# EAGLE design sapflux_base_v2.1 (EAGLE 8.5.2)
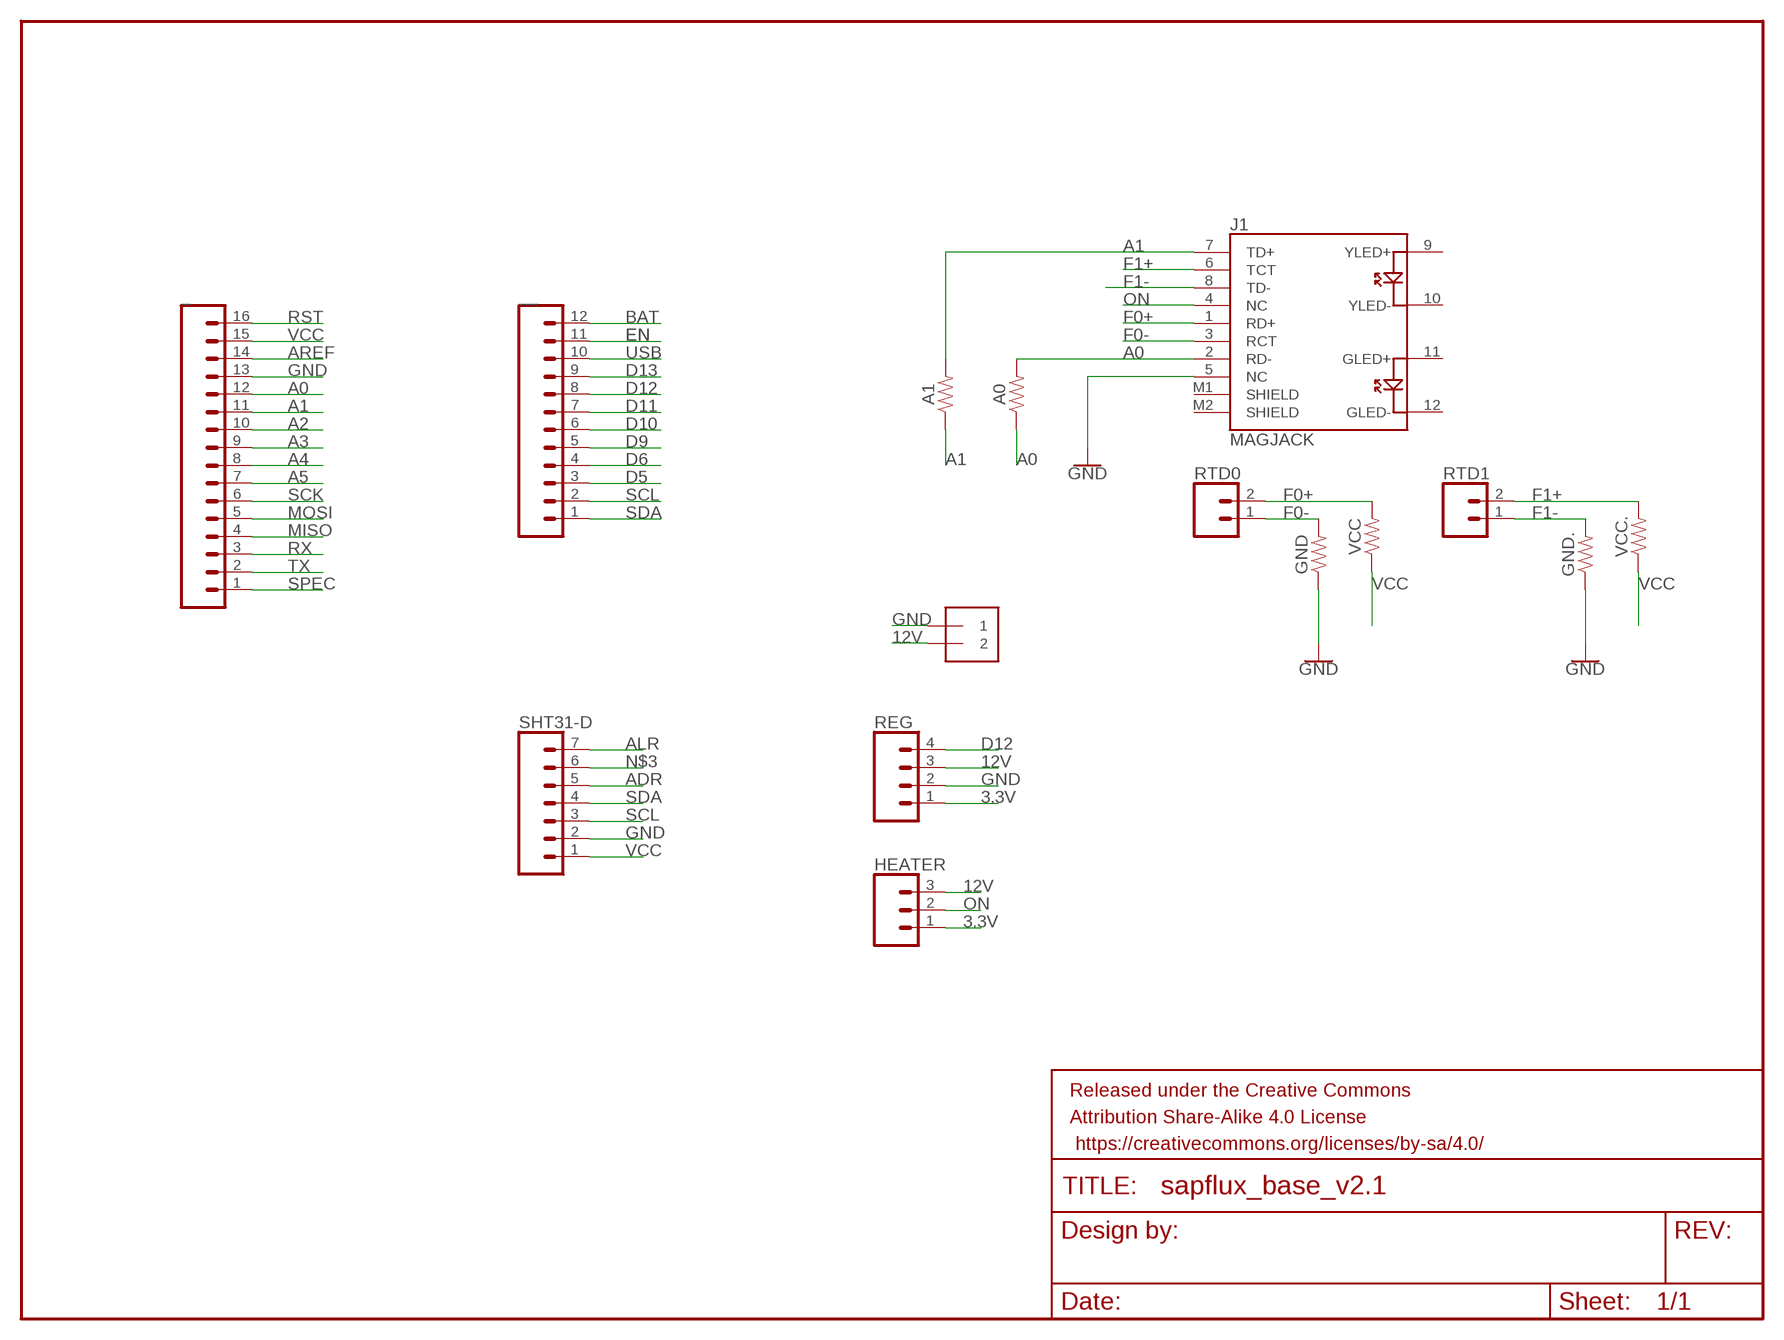
[diagram p0: schematic, sheet 1]

## Parts
.  1X2-3.5MM  [1X2-3.5MM]
_  CONN_16  [1X16]
__  CONN_12  [1X12]
A0  1.8MOHM  [0603]
A1  1.8MOHM  [0603]
FRAME1  FRAME-LETTER  [CREATIVE_COMMONS]
GND  1.8MOHM  [0603]
GND.  1.8MOHM  [0603]
HEATER  CONN_03  [1X03]
J1  MAGJACK  [MAGJACK]
REG  CONN_04  [1X04]
RTD0  CONN_02  [1X02]
RTD1  CONN_02  [1X02]
SHT31-D  CONN_07  [1X07]
VCC  1.8MOHM  [0603]
VCC.  1.8MOHM  [0603]

## Nets
3.3V: HEATER.1 REG.1
12V: ..2 HEATER.3 REG.3
A0: _.12 A0.1 A0.2 J1.2(RD-)
A1: _.11 A1.1 A1.2 J1.7(TD+)
A2: _.10
A3: _.9
A4: _.8
A5: _.7
ADR: SHT31-D.5
ALR: SHT31-D.7
AREF: _.14
BAT: __.12
D5: __.3
D6: __.4
D9: __.5
D10: __.6
D11: __.7
D12: __.8 REG.4
D13: __.9
EN: __.11
F0+: J1.1(RD+) RTD0.2 VCC.2
F0-: GND.2 J1.3(RCT) RTD0.1
F1+: J1.6(TCT) RTD1.2 VCC..2
F1-: GND..2 J1.8(TD-) RTD1.1
GND: ..1 _.13 GND.1 GND..1 J1.5(NC) REG.2 SHT31-D.2
MISO: _.4
MOSI: _.5
N$3: SHT31-D.6
ON: HEATER.2 J1.4(NC)
RST: _.16
RX: _.3
SCK: _.6
SCL: __.2 SHT31-D.3
SDA: __.1 SHT31-D.4
SPEC: _.1
TX: _.2
USB: __.10
VCC: _.15 SHT31-D.1 VCC.1 VCC..1
Unconnected: J1.9(YLED+) J1.10(YLED-) J1.11(GLED+) J1.12(GLED-) J1.M1(SHIELD) J1.M2(SHIELD)

## Library data of the parts
. = adafruit:1X2: 3.5mm Terminal block http://www.ladyada.net/library/pcb/eaglelibrary.html
_ = SparkFun-Connectors:CONN_16: Multi connection point. Often used as Generic Header-pin footprint for 0.1 inch spaced/style header connections On any of the 0.1 inch spaced packages, you can populate with these: Break Away Headers - Straight <https://www.sparkfun.com/products/116> (PRT-00116) Break Away Male Headers - Right Angle <https://www.sparkfun.com/products/553> (PRT-00553) Female Headers <https://www.sparkfun.com/products/115> (PRT-00115) Break Away Headers - Machine Pin <https://www.sparkfun.com/products/117> (PRT-00117) Break Away Female Headers - Swiss Machine Pin <https://www.sparkfun.com/products/743> (PRT-00743) For SCREWTERMINALS and SPRING TERMINALS visit here: Screw Terimnals on SparkFun.com <https://www.sparkfun.com/search/results?term=Screw+Terminals> (5mm/3.5mm/2.54mm spacing) This device is also useful as a general connection point to wire up your design to another part of your project. Our various solder wires solder well into these plated through hole pads. Hook-Up Wire - Assortment (Stranded, 22 AWG) <https://www.sparkfun.com/products/11375> (PRT-11375) Hook-Up Wire - Assortment (Solid Core, 22 AWG) <https://www.sparkfun.com/products/11367> (PRT-11367) View the entire wire category on our website here <https://www.sparkfun.com/categories/141> Special notes: Molex polarized connector foot print use with SKU : PRT-08231 with associated crimp pins and housings. 1MM SMD Version SKU: PRT-10208 NOTES ON THE VARIANTS LOCK and LOCK_LONGPADS... This footprint was designed to help hold the alignment of a through-hole component (i.e. 6-pin header) while soldering it into place. You may notice that each hole has been shifted either up or down by 0.005 of an inch from it's more standard position (which is a perfectly straight line). This slight alteration caused the pins (the squares in the middle) to touch the edges of the holes. Because they are alternating, it causes a "brace" to hold the component in place. 0.005 has proven to be the perfect amount of "off-center" position when using our standard breakaway headers. Although looks a little odd when you look at the bare footprint, once you have a header in there, the alteration is very hard to notice. Also,if you push a header all the way into place, it is covered up entirely on the bottom side.
__ = SparkFun-Connectors:CONN_12: Multi connection point. Often used as Generic Header-pin footprint for 0.1 inch spaced/style header connections On any of the 0.1 inch spaced packages, you can populate with these: Break Away Headers - Straight <https://www.sparkfun.com/products/116> (PRT-00116) Break Away Male Headers - Right Angle <https://www.sparkfun.com/products/553> (PRT-00553) Female Headers <https://www.sparkfun.com/products/115> (PRT-00115) Break Away Headers - Machine Pin <https://www.sparkfun.com/products/117> (PRT-00117) Break Away Female Headers - Swiss Machine Pin <https://www.sparkfun.com/products/743> (PRT-00743) For SCREWTERMINALS and SPRING TERMINALS visit here: Screw Terimnals on SparkFun.com <https://www.sparkfun.com/search/results?term=Screw+Terminals> (5mm/3.5mm/2.54mm spacing) This device is also useful as a general connection point to wire up your design to another part of your project. Our various solder wires solder well into these plated through hole pads. Hook-Up Wire - Assortment (Stranded, 22 AWG) <https://www.sparkfun.com/products/11375> (PRT-11375) Hook-Up Wire - Assortment (Solid Core, 22 AWG) <https://www.sparkfun.com/products/11367> (PRT-11367) View the entire wire category on our website here <https://www.sparkfun.com/categories/141> Special notes: Molex polarized connector foot print use with SKU : PRT-08231 with associated crimp pins and housings. 1MM SMD Version SKU: PRT-10208 NOTES ON THE VARIANTS LOCK and LOCK_LONGPADS... This footprint was designed to help hold the alignment of a through-hole component (i.e. 6-pin header) while soldering it into place. You may notice that each hole has been shifted either up or down by 0.005 of an inch from it's more standard position (which is a perfectly straight line). This slight alteration caused the pins (the squares in the middle) to touch the edges of the holes. Because they are alternating, it causes a "brace" to hold the component in place. 0.005 has proven to be the perfect amount of "off-center" position when using our standard breakaway headers. Although looks a little odd when you look at the bare footprint, once you have a header in there, the alteration is very hard to notice. Also,if you push a header all the way into place, it is covered up entirely on the bottom side.
A0 A1 GND GND. VCC VCC. = SparkFun-Resistors 2:1.8MOHM: 1.8 MOhms ±5% 0.1W, 1/10W Chip Resistor 0603; PROD_ID: RES-13994; VALUE: 1.8M
FRAME1 = SparkFun-Aesthetics:FRAME-LETTER: Schematic Frame - Letter Standard 8.5x11 US Letter frame
HEATER = SparkFun-Connectors:CONN_03: Multi connection point. Often used as Generic Header-pin footprint for 0.1 inch spaced/style header connections On any of the 0.1 inch spaced packages, you can populate with these: Break Away Headers - Straight <https://www.sparkfun.com/products/116> (PRT-00116) Break Away Male Headers - Right Angle <https://www.sparkfun.com/products/553> (PRT-00553) Female Headers <https://www.sparkfun.com/products/115> (PRT-00115) Break Away Headers - Machine Pin <https://www.sparkfun.com/products/117> (PRT-00117) Break Away Female Headers - Swiss Machine Pin <https://www.sparkfun.com/products/743> (PRT-00743) Stackable Header - 3 Pin (Female, 0.1") <https://www.sparkfun.com/products/13875> (PRT-13875) For SCREWTERMINALS and SPRING TERMINALS visit here: Screw Terimnals on SparkFun.com <https://www.sparkfun.com/search/results?term=Screw+Terminals> (5mm/3.5mm/2.54mm spacing) This device is also useful as a general connection point to wire up your design to another part of your project. Our various solder wires solder well into these plated through hole pads. Hook-Up Wire - Assortment (Stranded, 22 AWG) <https://www.sparkfun.com/products/11375> (PRT-11375) Hook-Up Wire - Assortment (Solid Core, 22 AWG) <https://www.sparkfun.com/products/11367> (PRT-11367) View the entire wire category on our website here <https://www.sparkfun.com/categories/141> Special notes: Molex polarized connector foot print use with SKU : PRT-08232 with associated crimp pins and housings.; PROD_ID: XXX-00000; VALUE: 455-1750-1-ND
J1 = SparkFun-Connectors:MAGJACK: MAGJACK: RJ-45 with LEDs This is a single port, RJ45 ethernet jacks with built in transformer (magnetics), status LEDs, and shielding. Here is the connector we sell at SparkFun: RJ45 Ethernet MagJack-Compatible <https://www.sparkfun.com/products/8534> (PRT-08534) Datasheet <http://www.sparkfun.com/datasheets/Prototyping/MagJack.pdf> It is used on this SparkFun product: SparkFun RJ45 MagJack Breakout <https://www.sparkfun.com/products/13021> (BOB-13021); PROD_ID: CONN-09556; SF_ID: PRT-08534
REG = SparkFun-Connectors:CONN_04: Multi connection point. Often used as Generic Header-pin footprint for 0.1 inch spaced/style header connections On any of the 0.1 inch spaced packages, you can populate with these: Break Away Headers - Straight <https://www.sparkfun.com/products/116> (PRT-00116) Break Away Male Headers - Right Angle <https://www.sparkfun.com/products/553> (PRT-00553) Female Headers <https://www.sparkfun.com/products/115> (PRT-00115) Break Away Headers - Machine Pin <https://www.sparkfun.com/products/117> (PRT-00117) Break Away Female Headers - Swiss Machine Pin <https://www.sparkfun.com/products/743> (PRT-00743) For SCREWTERMINALS and SPRING TERMINALS visit here: Screw Terimnals on SparkFun.com <https://www.sparkfun.com/search/results?term=Screw+Terminals> (5mm/3.5mm/2.54mm spacing) This device is also useful as a general connection point to wire up your design to another part of your project. Our various solder wires solder well into these plated through hole pads. Hook-Up Wire - Assortment (Stranded, 22 AWG) <https://www.sparkfun.com/products/11375> (PRT-11375) Hook-Up Wire - Assortment (Solid Core, 22 AWG) <https://www.sparkfun.com/products/11367> (PRT-11367) View the entire wire category on our website here <https://www.sparkfun.com/categories/141> Special notes: Molex polarized connector foot print use with SKU : PRT-08231 with associated crimp pins and housings. 1MM SMD Version SKU: PRT-10208; PROD_ID: CONN-09696
RTD0 RTD1 = SparkFun-Connectors:CONN_02: Multi connection point. Often used as Generic Header-pin footprint for 0.1 inch spaced/style header connections On any of the 0.1 inch spaced packages, you can populate with these: Break Away Headers - Straight <https://www.sparkfun.com/products/116> (PRT-00116) Break Away Male Headers - Right Angle <https://www.sparkfun.com/products/553> (PRT-00553) Female Headers <https://www.sparkfun.com/products/115> (PRT-00115) Break Away Headers - Machine Pin <https://www.sparkfun.com/products/117> (PRT-00117) Break Away Female Headers - Swiss Machine Pin <https://www.sparkfun.com/products/743> (PRT-00743) For SCREWTERMINALS and SPRING TERMINALS visit here: Screw Terimnals on SparkFun.com <https://www.sparkfun.com/search/results?term=Screw+Terminals> (5mm/3.5mm/2.54mm spacing) This device is also useful as a general connection point to wire up your design to another part of your project. Our various solder wires solder well into these plated through hole pads. Hook-Up Wire - Assortment (Stranded, 22 AWG) <https://www.sparkfun.com/products/11375> (PRT-11375) Hook-Up Wire - Assortment (Solid Core, 22 AWG) <https://www.sparkfun.com/products/11367> (PRT-11367) View the entire wire category on our website here <https://www.sparkfun.com/categories/141> Special notes: Molex polarized connector foot print use with: PRT-08233 with associated crimp pins and housings. 2.54_SCREWTERM for use with PRT-10571. 3.5mm Screw Terminal footprints for PRT-08084 5mm Screw Terminal footprints for use with PRT-08432
SHT31-D = SparkFun-Connectors:CONN_07: Multi connection point. Often used as Generic Header-pin footprint for 0.1 inch spaced/style header connections On any of the 0.1 inch spaced packages, you can populate with these: Break Away Headers - Straight <https://www.sparkfun.com/products/116> (PRT-00116) Break Away Male Headers - Right Angle <https://www.sparkfun.com/products/553> (PRT-00553) Female Headers <https://www.sparkfun.com/products/115> (PRT-00115) Break Away Headers - Machine Pin <https://www.sparkfun.com/products/117> (PRT-00117) Break Away Female Headers - Swiss Machine Pin <https://www.sparkfun.com/products/743> (PRT-00743) For SCREWTERMINALS and SPRING TERMINALS visit here: Screw Terimnals on SparkFun.com <https://www.sparkfun.com/search/results?term=Screw+Terminals> (5mm/3.5mm/2.54mm spacing) This device is also useful as a general connection point to wire up your design to another part of your project. Our various solder wires solder well into these plated through hole pads. Hook-Up Wire - Assortment (Stranded, 22 AWG) <https://www.sparkfun.com/products/11375> (PRT-11375) Hook-Up Wire - Assortment (Solid Core, 22 AWG) <https://www.sparkfun.com/products/11367> (PRT-11367) View the entire wire category on our website here <https://www.sparkfun.com/categories/141> Special notes: Molex polarized connector foot print use with SKU : PRT-08231 with associated crimp pins and housings. 1MM SMD Version SKU: PRT-10208 NOTES ON THE VARIANTS LOCK and LOCK_LONGPADS... This footprint was designed to help hold the alignment of a through-hole component (i.e. 6-pin header) while soldering it into place. You may notice that each hole has been shifted either up or down by 0.005 of an inch from it's more standard position (which is a perfectly straight line). This slight alteration caused the pins (the squares in the middle) to touch the edges of the holes. Because they are alternating, it causes a "brace" to hold the component in place. 0.005 has proven to be the perfect amount of "off-center" position when using our standard breakaway headers. Although looks a little odd when you look at the bare footprint, once you have a header in there, the alteration is very hard to notice. Also,if you push a header all the way into place, it is covered up entirely on the bottom side.

## Net classes
0 default: width 0.254 mm, clearance 0.205 mm
1 GND: width 0.61 mm

## Board
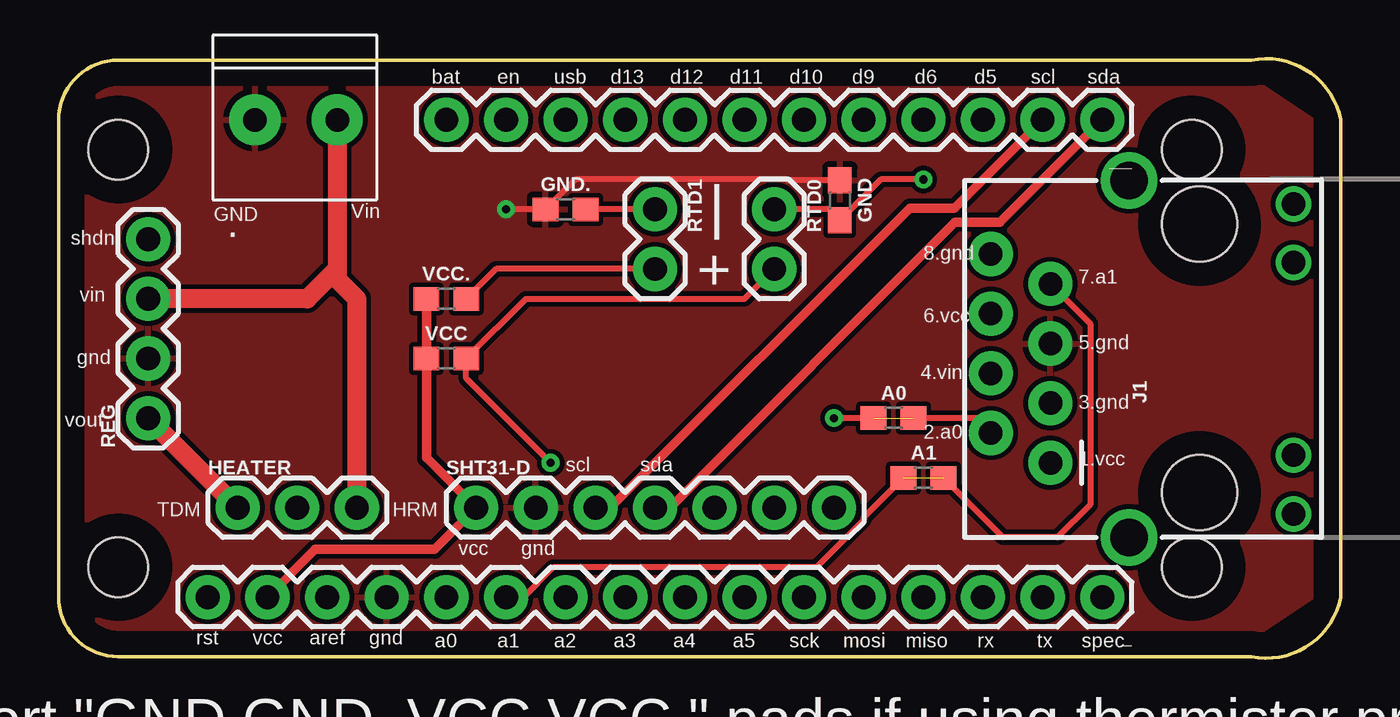
[diagram p1: board, top side]
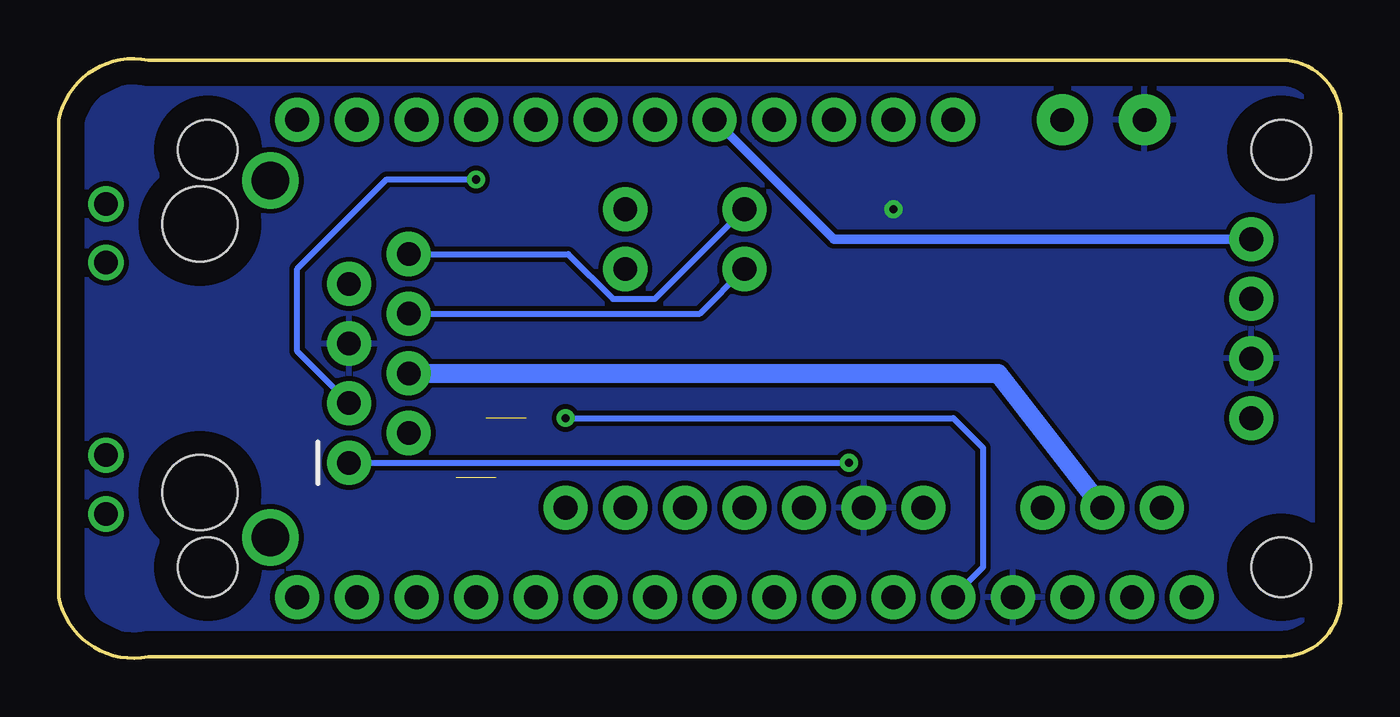
[diagram p2: board, bottom side, seen from below]

Size 54.61 x 25.53 mm. Coordinates in mm from the lower left corner, seen from the top.
Outline: 0,22.92 0,2.6 arc90 2.54,0.06 50.8,0.06 arc90 54.61,2.6 54.61,22.92 arc90 50.8,25.46 2.54,25.46 arc90 0,22.92
Copper layers (1*16): Top 0.035mm / dielectric 1.5mm / Bottom 0.035mm
Design rules "default": minimum track width 6mil, minimum drill 0.35mm, track to track 6mil, track to pad 6mil, pad to pad 6mil, via to via 6mil, smd to smd 6mil, copper to edge 40mil, drill to drill 6mil, minimum pad ring 10mil, minimum via ring 8mil, stop-mask expansion 4mil, vias tented up to drill 0mil, thermal gap 10mil
Holes 2.54 mm at 48.26,3.87 48.26,21.65 2.54,3.87 2.54,21.65

### Footprints (pad centres in the part's own frame; a part is rotated, then mirrored left to right if it is on the bottom)
1X2-3.5MM = drill 1 pad 2.184: 1 1.8,0; 2 -1.7,0
1X16 = drill 1.016 pad 1.88: 1 0,0; 2 2.54,0; 3 5.08,0; 4 7.62,0; 5 10.16,0; 6 12.7,0; 7 15.24,0; 8 17.78,0; 9 20.32,0; 10 22.86,0; 11 25.4,0; 12 27.94,0; 13 30.48,0; 14 33.02,0; 15 35.56,0; 16 38.1,0
1X12 = drill 1.016 pad 1.88: 1 0,0; 2 2.54,0; 3 5.08,0; 4 7.62,0; 5 10.16,0; 6 12.7,0; 7 15.24,0; 8 17.78,0; 9 20.32,0; 10 22.86,0; 11 25.4,0; 12 27.94,0
0603 = smd 1.1 x 1: 1 -0.85,0; 2 0.85,0
1X03 = drill 1.016 pad 1.88: 1 0,0; 2 2.54,0; 3 5.08,0
MAGJACK = drill 1 pad 1.88: 1 3.175,17.445; 2 4.445,19.985; 3 5.715,17.445; 4 6.985,19.985; 5 8.255,17.445; 6 9.525,19.985; 7 10.795,17.445; 8 12.065,19.985 | drill 1 pad 1.27: 9 1,7.1; 10 3.5,7.1; 11 11.7,7.1; 12 14.2,7.1 | drill 1.6 pad 2.184: M1 0,14.1; M2 15.2,14.1 | hole 3.2: 1.905,11.095; 13.335,11.095
1X04 = drill 1.016 pad 1.88: 1 0,0; 2 2.54,0; 3 5.08,0; 4 7.62,0
1X02 = drill 1.016 pad 1.88: 1 0,0; 2 2.54,0
1X07 = drill 1.016 pad 1.88: 1 0,0; 2 2.54,0; 3 5.08,0; 4 7.62,0; 5 10.16,0; 6 12.7,0; 7 15.24,0

### Placement (x,y rotation side)
.  10.16,22.92 180 top
_  44.45,2.6 180 top
__  44.45,22.92 180 top
A0  35.56,10.22 0 top
A1  36.83,7.68 0 top
FRAME1  -88.9,1.33 0 top  (outside the outline)
GND  33.27,19.49 270 top
GND.  21.59,19.11 0 top
HEATER  7.62,6.41 0 top
J1  59.69,5.14 90 top
REG  3.81,10.22 90 top
RTD0  30.48,19.11 270 top
RTD1  25.4,19.11 270 top
SHT31-D  17.78,6.41 0 top
VCC  16.51,12.76 0 top
VCC.  16.51,15.3 0 top

### Tracks (layer width: path | path; a pad name or v marks a point on that pad's centre or on a via)
3.3V
  Top 0.813: REG.1 HEATER.1
12V
  Top 0.813: ..2 11.86,16.57 | 11.86,16.57 11.86,16.14 12.7,15.3 HEATER.3 | 11.86,16.57 10.59,15.3 REG.3
A0  (via drill 0.35)  (1 unrouted)
  Top 0.254: J1.2 39.07,10.22 A0.2 | A0.1 v33.02,10.22
  Bottom 0.254: v33.02,10.22 16.51,10.22 15.24,8.95 15.24,3.87 _.12
A1  (1 unrouted)
  Top 0.254: J1.7 43.94,14.24 43.94,6.54 42.55,5.14 40.22,5.14 A1.2 | A1.1 34.29,5.99 34.29,5.89 32.28,3.87 21.06,3.87 19.79,2.6 _.11
D12
  Bottom 0.406: REG.4 21.59,17.84 __.8
F0+  (via drill 0.35)
  Top 0.254: v20.95,8.32 17.36,11.91 VCC.2 19.9,15.3 25.93,15.3 29.21,15.3 RTD0.2
  Bottom 0.254: J1.1 40.23,8.32 21.08,8.32 20.95,8.19 v20.95,8.32
F0-  (via drill 0.35)
  Top 0.254: RTD0.1 32.8,19.11 GND.2 35.01,20.38 v36.83,20.38
  Bottom 0.254: J1.3 44.45,13.06 44.45,16.57 40.64,20.38 v36.83,20.38
F1+
  Top 0.254: RTD1.2 18.63,16.57 VCC..2
  Bottom 0.254: J1.6 27.3,14.67 RTD1.2
F1-
  Top 0.254: RTD1.1 GND..2
  Bottom 0.254: J1.8 32.91,17.21 31.01,15.3 29.21,15.3 RTD1.1
GND  (via drill 0.35)
  Top 0.254: v19.05,19.11 GND..1 22.01,20.38 31.01,20.38 31.05,20.34 GND.1
  pour Top: 0,22.92 0,2.6 2.54,0.06 49.53,0.06 53.34,2.6 53.34,22.92 49.53,25.46 2.54,25.46
  pour Bottom: 0,22.92 0,2.6 2.54,0.06 49.53,0.06 54.61,2.6 54.61,22.92 49.53,25.46 2.54,25.46
ON
  Bottom 0.813: J1.4 14.61,12.13 HEATER.2
SCL
  Top 0.406: __.2 38.15,19.17 36.25,19.17 23.49,6.41 SHT31-D.3
SDA
  Top 0.406: __.1 40.08,18.56 38.18,18.56 26.03,6.41 SHT31-D.4
VCC
  Top 0.406: _.15 10.92,4.63 16,4.63 SHT31-D.1 15.66,8.53 VCC.1 VCC..1

### Text on the board
tPlace: bat | en | usb | d13 | d12 | d11 | d10 | d9 | d6 | d5 | scl | sda | GND | Vin | shdn | | | 8.gnd | + | 7.a1 | vin | 6.vcc | 5.gnd | gnd | 4.vin | 3.gnd | vout | 2.a0 | scl | sda | 1.vcc | TDM | HRM | vcc | gnd | rst | vcc | aref | gnd | a0 | a1 | a2 | a3 | a4 | a5 | sck | mosi | miso | rx | tx | spec | 1. Short "GND,GND.,VCC,VCC." pads if using thermistor probe. / Leave them open when using PT100. / And connect two 2-wire PT100 to the headers.